# Altium schematic sheet PDOC.SchDoc
size A4; SheetNumber: 6; SheetTotal: 10
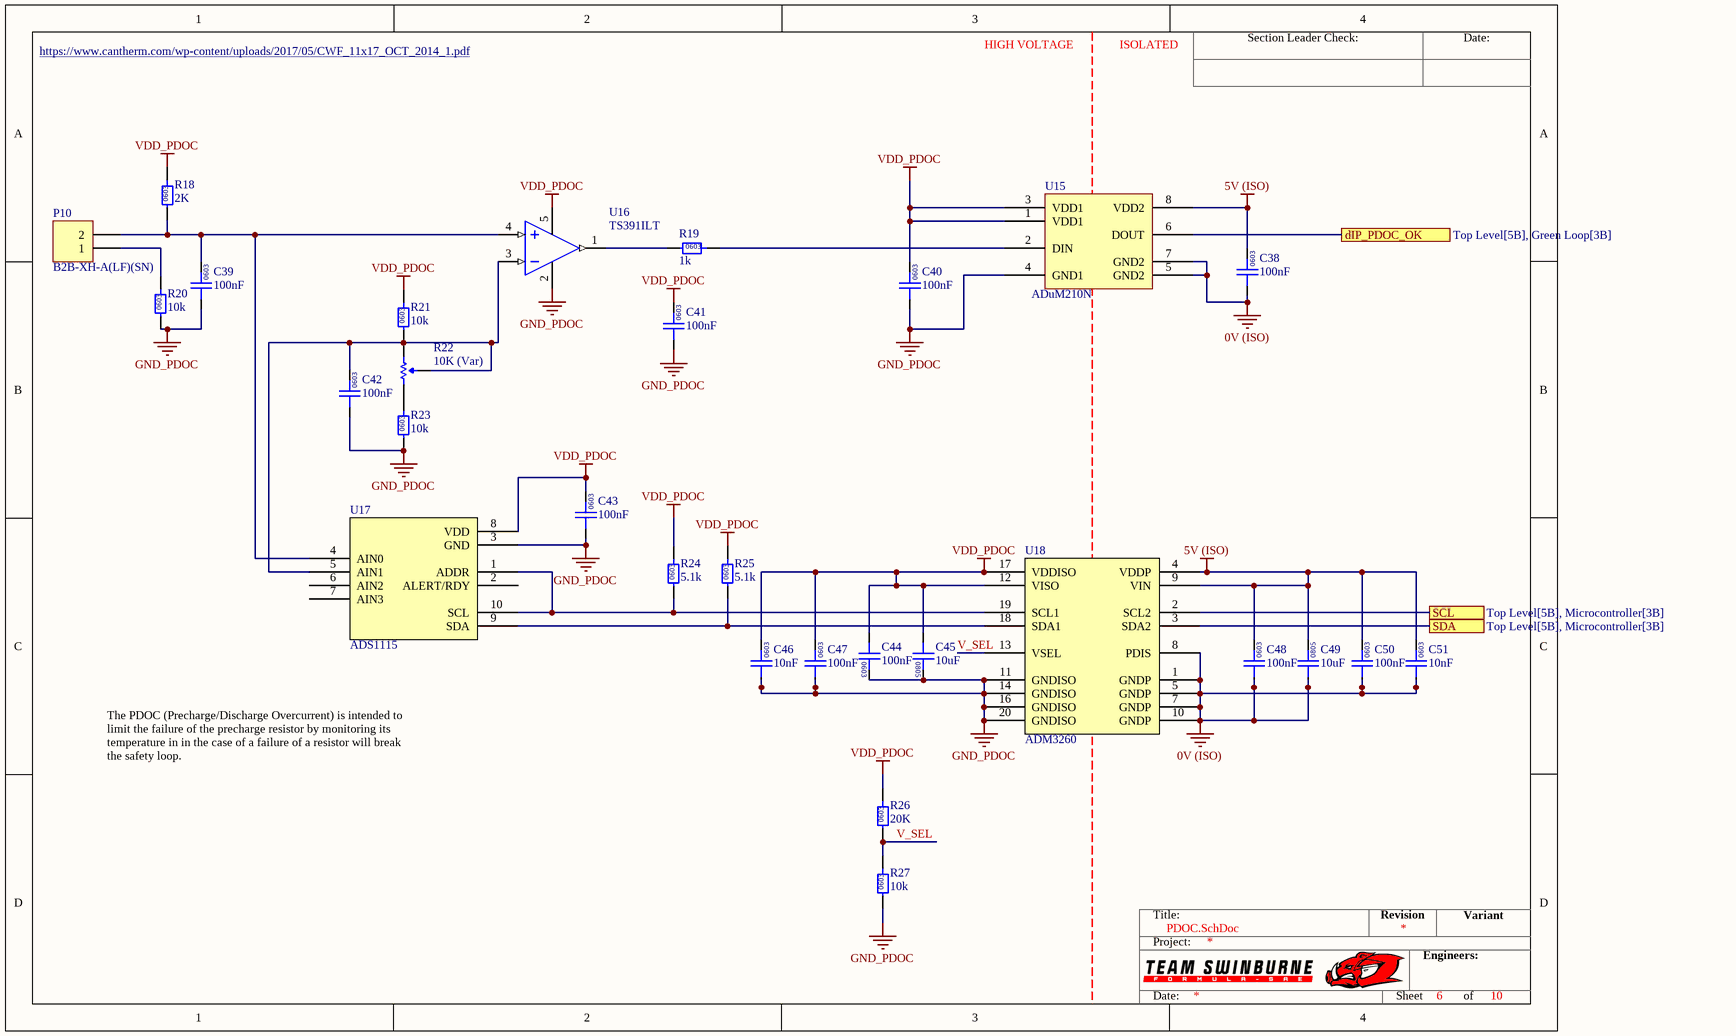
[diagram p0: PDOC.SchDoc]

## Parts
C38  100nF  [0603]
C39  100nF  [0603]
C40  100nF  [0603]
C41  100nF  [0603]
C42  100nF  [0603]
C43  100nF  [0603]
C44  100nF  [0603]
C45  10uF  [0805]
C46  10nF  [0603]
C47  100nF  [0603]
C48  100nF  [0603]
C49  10uF  [0805]
C50  100nF  [0603]
C51  10nF  [0603]
P10  B2B-XH-A(LF)(SN)  [XH 2 PIN VERT]
R18  2K  [0603]
R19  1k  [0603]
R20  10k  [0603]
R21  10k  [0603]
R22  10K (Var)  [B 3296]
R23  10k  [0603]
R24  5.1k  [0603]
R25  5.1k  [0603]
R26  20K  [0603]
R27  10k  [0603]
U15  ADuM210N  [SOIC-8W]
U16  TS391ILT  [ON SOT-23-5]
U17  ADS1115  [TI 10-VSSOP]
U18  ADM3260  [AD 20-SSOP]

## Ports
dIP_PDOC_OK (see Top Level[5B], Green Loop[3B]), SCL (see Top Level[5B], Microcontroller[3B]), SDA (see Top Level[5B], Microcontroller[3B])

## Nets
0V (ISO): C38.1 C48.1 C49.1 C50.1 C51.1 U15.5(GND2) U15.7(GND2) U18.1(GNDP) U18.5(GNDP) U18.7(GNDP) U18.8(PDIS) U18.10(GNDP)
5V (ISO): C38.2 C48.2 C49.2 C50.2 C51.2 U15.8(VDD2) U18.4(VDDP) U18.9(VIN)
GND_PDOC: C39.1 C40.1 C41.1 C42.1 C43.1 C44.2 C45.2 C46.1 C47.1 R20.1 R23.1 R27.1 U15.4(GND1) U16.2(VCC-) U17.3(GND) U18.11(GNDISO) U18.14(GNDISO) U18.16(GNDISO) U18.20(GNDISO)
VDD_PDOC: C40.2 C41.2 C43.2 C44.1 C45.1 C46.2 C47.2 R18.2 R21.2 R24.2 R25.2 R26.2 U15.1(VDD1) U15.3(VDD1) U16.5(VCC+) U17.8(VDD) U18.12(VISO) U18.17(VDDISO)
dIP_PDOC_OK: U15.6(DOUT) ; port dIP_PDOC_OK
SCL: U18.2(SCL2) ; port SCL
SDA: U18.3(SDA2) ; port SDA
V_SEL: R26.1 R27.2 U18.13(VSEL)
NetC39_2: C39.2 P10.2 R18.1 U16.4(IIN+) U17.4(AIN0)
NetC42_2: C42.2 R21.1 R22.1(CCW) R22.2(Wiper) U16.3(IN-) U17.5(AIN1)
NetP10_1: P10.1 R20.2
NetR19_1: R19.1 U16.1(OUT)
NetR19_2: R19.2 U15.2(DIN)
NetR22_3: R22.3(CW) R23.2
NetR24_1: R24.1 U17.1(ADDR) U17.10(SCL) U18.19(SCL1)
NetR25_1: R25.1 U17.9(SDA) U18.18(SDA1)

Not connected (* = marked no-connect by the designer): U17 2(ALERT/RDY) 6(AIN2) 7(AIN3)

## Notes on the sheet
- https://www.cantherm.com/wp-content/uploads/2017/05/CWF_11x17_OCT_2014_1.pdf
- HIGH VOLTAGE
- ISOLATED
- The PDOC (Precharge/Discharge Overcurrent) is intended to limit the failure of the precharge resistor by monitoring its temperature in in the case of a failure of a resistor will break the safety loop.
- Section Leader Check:
- Date:
- Title:
- Revision
- Variant
- Project:
- Engineers:
- Sheet
- of
- (in symbol GCM188L81H103KA03D) 0603
- (in symbol GCM188L81H104KA57D) 0603
- (in symbol GRM21BR6YA106KE43L) 0805
- (in symbol RC0603FR-071KL) 0603
- (in symbol RC0603FR-072KL) 0603
- (in symbol RC0603FR-0710KL) 0603
- (in symbol RC0603FR-0720KL) 0603
- (in symbol RC0603JR-075K1L) 0603

## Library data of the parts
C38-C44 C47 C48 C50 = GCM188L81H104KA57D: Manufacturer: muRata; Rated Voltage: 50V; Tolerance: ±10%; Material: MLCC; Temperature Rating: X8L; Part Number: GCM188L81H104KA57D; Value: 100nF; Digikey Part Number: 490-6049-1-ND
C45 C49 = GRM21BR6YA106KE43L: Manufacturer: muRata; Rated Voltage: 50V; Tolerance: 10%; Material: MLCC; Temperature Rating: X5R; Part Number: GRM21BR6YA106KE43L; Value: 10uF; Digikey Part Number: 490-10514-6-ND
C46 C51 = GCM188L81H103KA03D: Manufacturer: muRata; Rated Voltage: 50V; Tolerance: ±10%; Material: MLCC; Temperature Rating: X8L; Part Number: GCM188L81H103KA03D; Value: 10nF; Digikey Part Number: 490-GCM188L81H103KA03DCT-ND
P10 = B2B-XH-A(LF)(SN): Positions: 2; Pitch: 2.54mm; Angle: 0; Flange: No; Contact: Tin; Part Number: B2B-XH-A(LF)(SN); Row Spacing: 2.54mm; Digikey Part Number: 455-2247-ND; Digikey Link: https://www.digikey.com.au/en/products/detail/jst-sales-america-inc/B2B-XH-A-LF-SN/1651045
R18 = RC0603FR-072KL: Manufacturer: YAGEO; Tolerance: 0.01; Rated Power: 0.1W; Part Number: RC0603FR-072KL; Value: 2K; Digikey Part Number: 311-2.00KHRCT-ND; Material: FR-07
R19 = RC0603FR-071KL: Manufacturer: YAGEO; Tolerance: 0.01; Rated Power: 0.1W; Part Number: RC0603FR-071KL; Value: 1k; Digikey Part Number: 311-1.00KHRCT-ND; Material: FR-07
R20 R21 R23 R27 = RC0603FR-0710KL: Manufacturer: YAGEO; Tolerance: 0.01; Rated Power: 0.1W; Part Number: RC0603FR-0710KL; Value: 10k; Digikey Part Number: 311-10.0KHRCT-ND; Material: FR-07
R22 = 3296W-1-103LF: Manufacturer: Bournes Inc; Tolerance: 0.1; Rated Power: 0.5W; Part Number: 3296W-1-103LF; Value: 10K (Var); Digikey Part Number: 3296W-103LF-ND
R24 R25 = RC0603JR-075K1L: Manufacturer: YAGEO; Tolerance: 0.01; Rated Power: 0.1W; Part Number: RC0603JR-075K1L; Value: 5.1k; Material: FR-07; Digikey Part Number: 311-5.1KGRCT-ND
R26 = RC0603FR-0720KL: Manufacturer: YAGEO; Tolerance: 0.01; Rated Power: 0.1W; Part Number: RC0603FR-0720KL; Value: 20K; Digikey Part Number: 311-20.0KHRCT-ND; Material: FR-07
U15 = CMP-110-000007-1: DIGITAL ISOLATOR, SINGLE CHANNEL; Digikey Link: #https://www.analog.com/media/en/technical-documentation/data-sheets/ADuM210N.pdf#; Part Number: ADuM210N
U16 = CMP-022-000013-1: IC COMP LO PWR SGL V SOT 23-5L; Part Number: TS391ILT
U17 = ADS1115: 16 Bit Analog to Digital Converter 2, 4 Input 1 Sigma-Delta 10-VSSOP; Manufacturer: Texas Instruments; Part Number: ADS1115; Digikey Part Number: 296-38849-1-ND
U18 = CMP-021-000012-1: I²C Digital Isolator 2500Vrms 2 Channel 25kV/µs CMTI 20-SSOP (0.209", 5.30mm Width); Part Number: ADM3260